# Altium schematic sheet 0_Overview.SchDoc: Overview
size A3; DocumentNumber: 1; SheetNumber: 1; SheetTotal: 6; PageSetup: Record=PageOptions|CenterHorizontal=True|CenterVertical=True|PrintScale=1.01|XCorrection=1.00|YCorrection=1.00|PrintKind=0|BorderSize=5000000|LeftOffset=0|BottomOffset=0|Orientation=2|PaperLength=1000|PaperWidth=1000|Scale=100|PaperSource=7|PrintQuality=-4|MediaType=1|DitherType=10|PaperKind=A3|PrintScaleMode=1
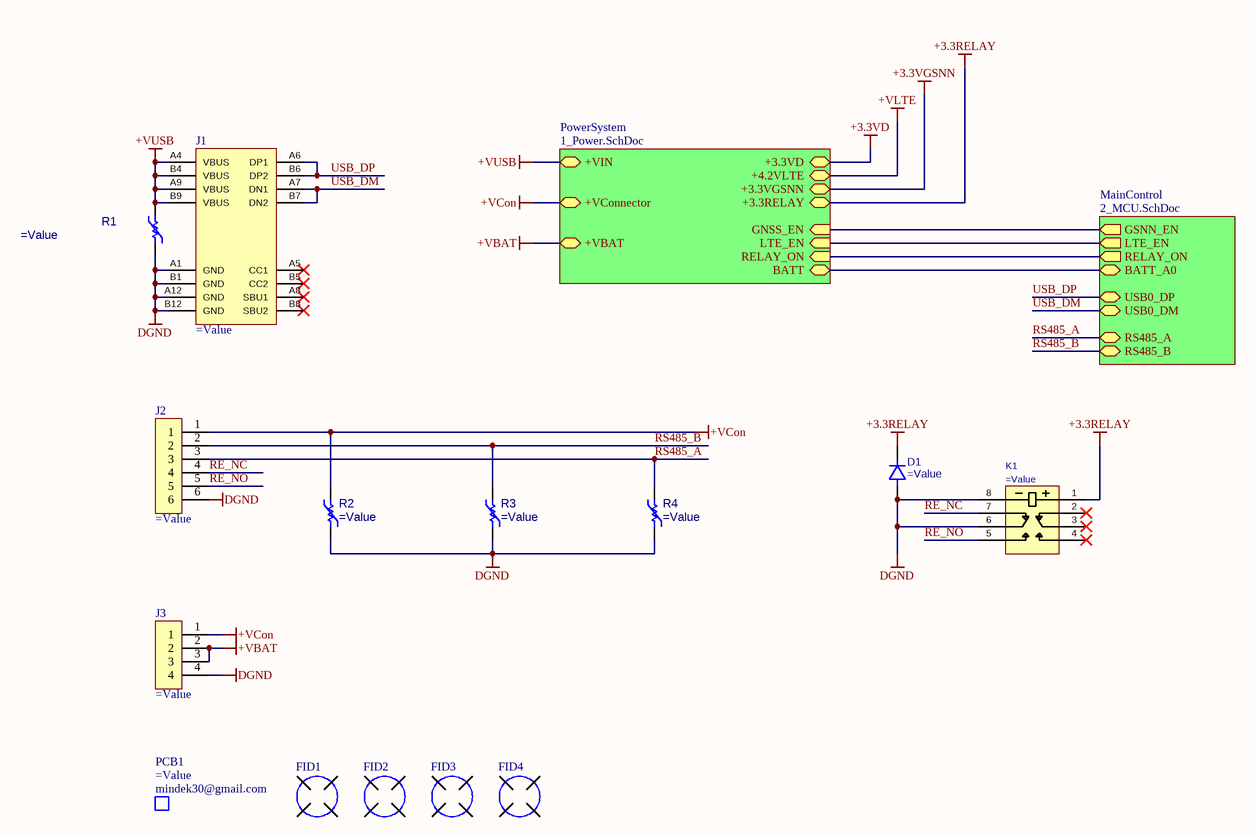
[diagram p0: 0_Overview.SchDoc]

## Parts
D1  (no value)  [SOD323]
FID1  FIDUCIAL  [FID]  (value not drawn)  (no BOM)
FID2  FIDUCIAL  [FID]  (value not drawn)  (no BOM)
FID3  FIDUCIAL  [FID]  (value not drawn)  (no BOM)
FID4  FIDUCIAL  [FID]  (value not drawn)  (no BOM)
J1  (no value)  [GCT_USB4085-GF-A_REVA4]
J2  (no value)  [CON_6P_Header]  (no BOM)
J3  (no value)  [CON_4P_Header]  (no BOM)
K1  (no value)  [RELAY_HFD4/12-SR]
PCB1  Manufacturer: mindek30@gmail.com  (mechanical)
R1  (no value)  [R_0603]
R2  (no value)  [R_0603]
R3  (no value)  [R_0603]
R4  (no value)  [R_0603]

## Sub-sheets
MainControl = 2_MCU.SchDoc: BATT_A0 (bidir), RS485_A (bidir), RS485_B (bidir), USB0_DP (bidir), USB0_DM (bidir), GSNN_EN (out), LTE_EN (out), RELAY_ON (out)
PowerSystem = 1_Power.SchDoc: BATT (bidir), +VIN (bidir), +3.3VD (bidir), GNSS_EN (in), LTE_EN (in), +VConnector (bidir), +4.2VLTE (bidir), +3.3VGSNN (bidir), +3.3RELAY (bidir), RELAY_ON (in), +VBAT (bidir)

## Nets
+3.3RELAY: D1.1 K1.1 ; sheet PowerSystem/+3.3RELAY
+3.3VD: sheet PowerSystem/+3.3VD
+3.3VGSNN: sheet PowerSystem/+3.3VGSNN
+VBAT: J3.2 J3.3 ; sheet PowerSystem/+VBAT
+VCon: J2.1 J3.1 R2.1 ; sheet PowerSystem/+VConnector
+VLTE: sheet PowerSystem/+4.2VLTE
+VUSB: J1.A4(VBUS) J1.A9(VBUS) J1.B4(VBUS) J1.B9(VBUS) R1.2 ; sheet PowerSystem/+VIN
DGND: D1.2 J1.A1(GND) J1.A12(GND) J1.B1(GND) J1.B12(GND) J2.6 J3.4 K1.6 K1.8 R1.1 R2.2 R3.1 R4.2
RE_NC: J2.4 K1.7
RE_NO: J2.5 K1.5
RS485_A: J2.3 R4.1 ; sheet MainControl/RS485_A
RS485_B: J2.2 R3.2 ; sheet MainControl/RS485_B
USB_DM: J1.A7(DN1) J1.B7(DN2) ; sheet MainControl/USB0_DM
USB_DP: J1.A6(DP1) J1.B6(DP2) ; sheet MainControl/USB0_DP
(unnamed): sheet MainControl/BATT_A0, sheet PowerSystem/BATT
(unnamed): sheet MainControl/GSNN_EN, sheet PowerSystem/GNSS_EN
(unnamed): sheet MainControl/LTE_EN, sheet PowerSystem/LTE_EN
(unnamed): sheet MainControl/RELAY_ON, sheet PowerSystem/RELAY_ON

Not connected (* = marked no-connect by the designer): J1 A5(CC1)* A8(SBU1)* B5(CC2)* B8(SBU2)*; K1 2* 3* 4*

## Notes on the sheet
- Title :
- Revision :
- ผู้จัดทำ:
- Size:
- A3
- Time:
- ผู้เขียน:
- บริษัท ยูนิเวอร์แซล ยูทีลิตี้ส์ จำกัด (มหาชน) เลขที่ 1 อาคาร อีสท์วอเตอร์ ชั้น 18 ซอยวิภาวดีรังสิต 5 แขวงจอมพล เขตจตุจักร กรุงเทพฯ 10900
  Tel : +662-272-1688
  Fax :+662-2721690-1
- -
- Sheet:
- of
- ผู้อำนวยการ
- ผู้ตรวจสอบ:
- Number:
- กรรมการผู้จัดการ:
- File:

## Library data of the parts
D1 = D_PW_SD103AWS: DIODE SCHOTTKY 40V 2A 0603; Manufacturer: Slkor(SLKORMICRO Elec.); Value: SD103AWS; PackageReference: SOD-323; PartID: C513472; PartNumber: SD103AWS
FID1-FID4 = FID_FIDUCIAL: Manufacturer: mindek30@gmail.com; Value2: Non SE; Value: Non SE; PartNumber: =PCB_PN+'_'+PCB_Rev; PartID: =PCB_Rev; PackageReference: Non SE; Value3: Non SE
J1 = CON_USBC_USB4085: CONN RCPT USB2.0 TYPE C 16+8POS; PartNumber: USB4085-GF-A; Manufacturer: GCT; Value: USB4085-GF-A; PartID: 2073-USB4085-GF-ACT-ND; PackageReference: *; Value2: *; Value3: *
J2 = CON_6P_Heder: Connector 6 position; PartNumber: *; PartID: *; Manufacturer: *; PackageReference: *; Value: *; Value2: *; Value3: *
J3 = CON_4P_Heder: Connector 4 position; PartNumber: *; PartID: *; Manufacturer: *; PackageReference: *; Value: *; Value2: *; Value3: *
K1 = SW_RELAY_HFD4/12-SR: Telecom Non Latching 3VDC DPDT SMD Relays RoHS; Manufacturer: Xiamen Hongfa Electroacoustic; Value: HFD4/3-S1R; PackageReference: *; PartID: C143232; PartNumber: HFD4/3-S1R
PCB1 = PCB_Bare: BARE PCB; PartNumber: =PCB_PN+'_'+PCB_Rev; PackageReference: Non SE; PartID: =PCB_Rev; Value2: =JobFile_Title; Value: =PartNumber; Value3: =PCBA_PN+'_'+PCBA_Rev
R1-R4 = R_VAR_VCAC060326C820MRP: VARISTOR 36V 30A 0603; Manufacturer: KYOCERA AVX; Value: VCAC060326C820MRP; PackageReference: 0603; PartID: 478-6255-1-ND; PartNumber: VCAC060326C820MRP